# Altium schematic sheet Shield.SchDoc
size A4
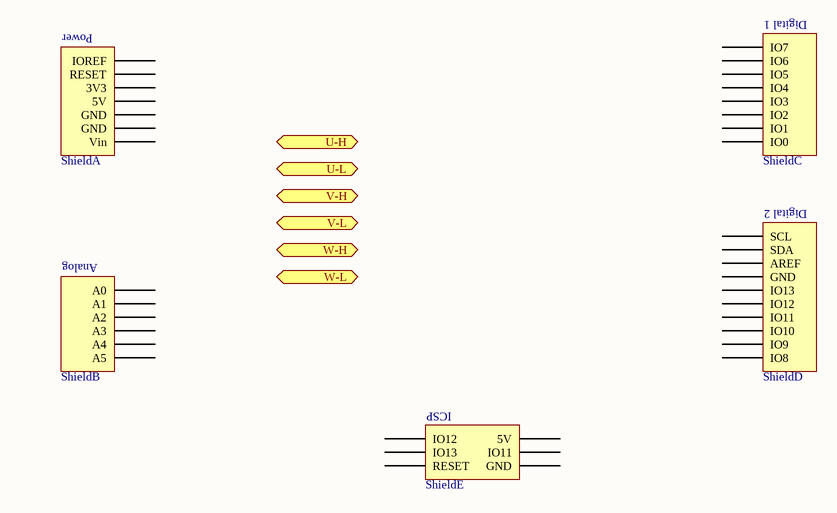
[diagram p0: Shield.SchDoc]

## Parts
Shield  Arduino Uno  [Arduino Uno Adapter]  (value not drawn)  (parts A,B,C,D,E of 5)

## Ports
U-H (out), U-L (out), V-H (out), V-L (out), W-H (out), W-L (out)

## Nets

Not connected (* = marked no-connect by the designer): Shield 0(IO0) 1(IO1) 2(IO2) 3(IO3) 3V3 4(IO4) 5(IO5) 5V 6(IO6) 7(IO7) 8(IO8) 9(IO9) 10(IO10) 11(IO11) 12(IO12) 13(IO13) A0 A1 A2 A3 A4 A5 AREF GND1(GND) GND2(GND) GND3(GND) ICSP1(IO12) ICSP2(5V) ICSP3(IO13) ICSP4(IO11) ICSP5(RESET) ICSP6(GND) IOREF RESET SCL SDA Vin

## Notes on the sheet
- (in symbol Arduino Uno, part A) Power
- (in symbol Arduino Uno, part B) Analog
- (in symbol Arduino Uno, part C) Digital 1
- (in symbol Arduino Uno, part D) Digital 2
- (in symbol Arduino Uno, part E) ICSP